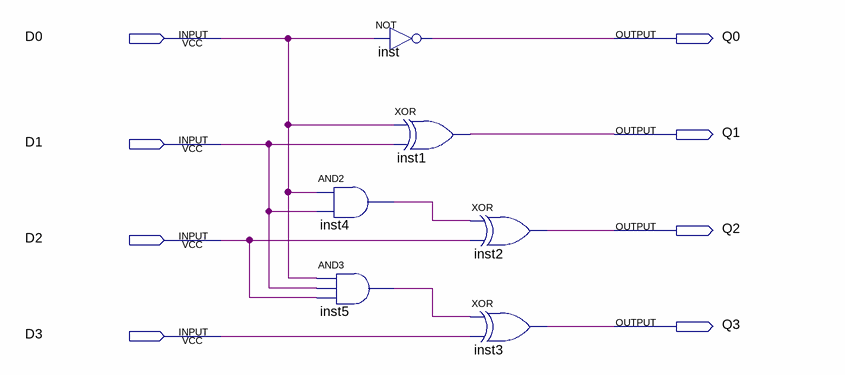
[diagram p0: schematic sheet]
// Quartus schematic Increment_4.bdf as structural Verilog: 6 symbols, 8 pins
module Increment_4 (
  input  D0,
  input  D1,
  input  D2,
  input  D3,
  output Q0,
  output Q1,
  output Q2,
  output Q3
);

  wire inst4_out, inst5_out;

  and inst4 (inst4_out, D0, D1);
  and inst5 (inst5_out, D0, D1, D2);
  not inst (Q0, D0);
  xor inst1 (Q1, D0, D1);
  xor inst2 (Q2, inst4_out, D2);
  xor inst3 (Q3, inst5_out, D3);
endmodule
